# EAGLE design chassis_board (EAGLE 9.6.2)
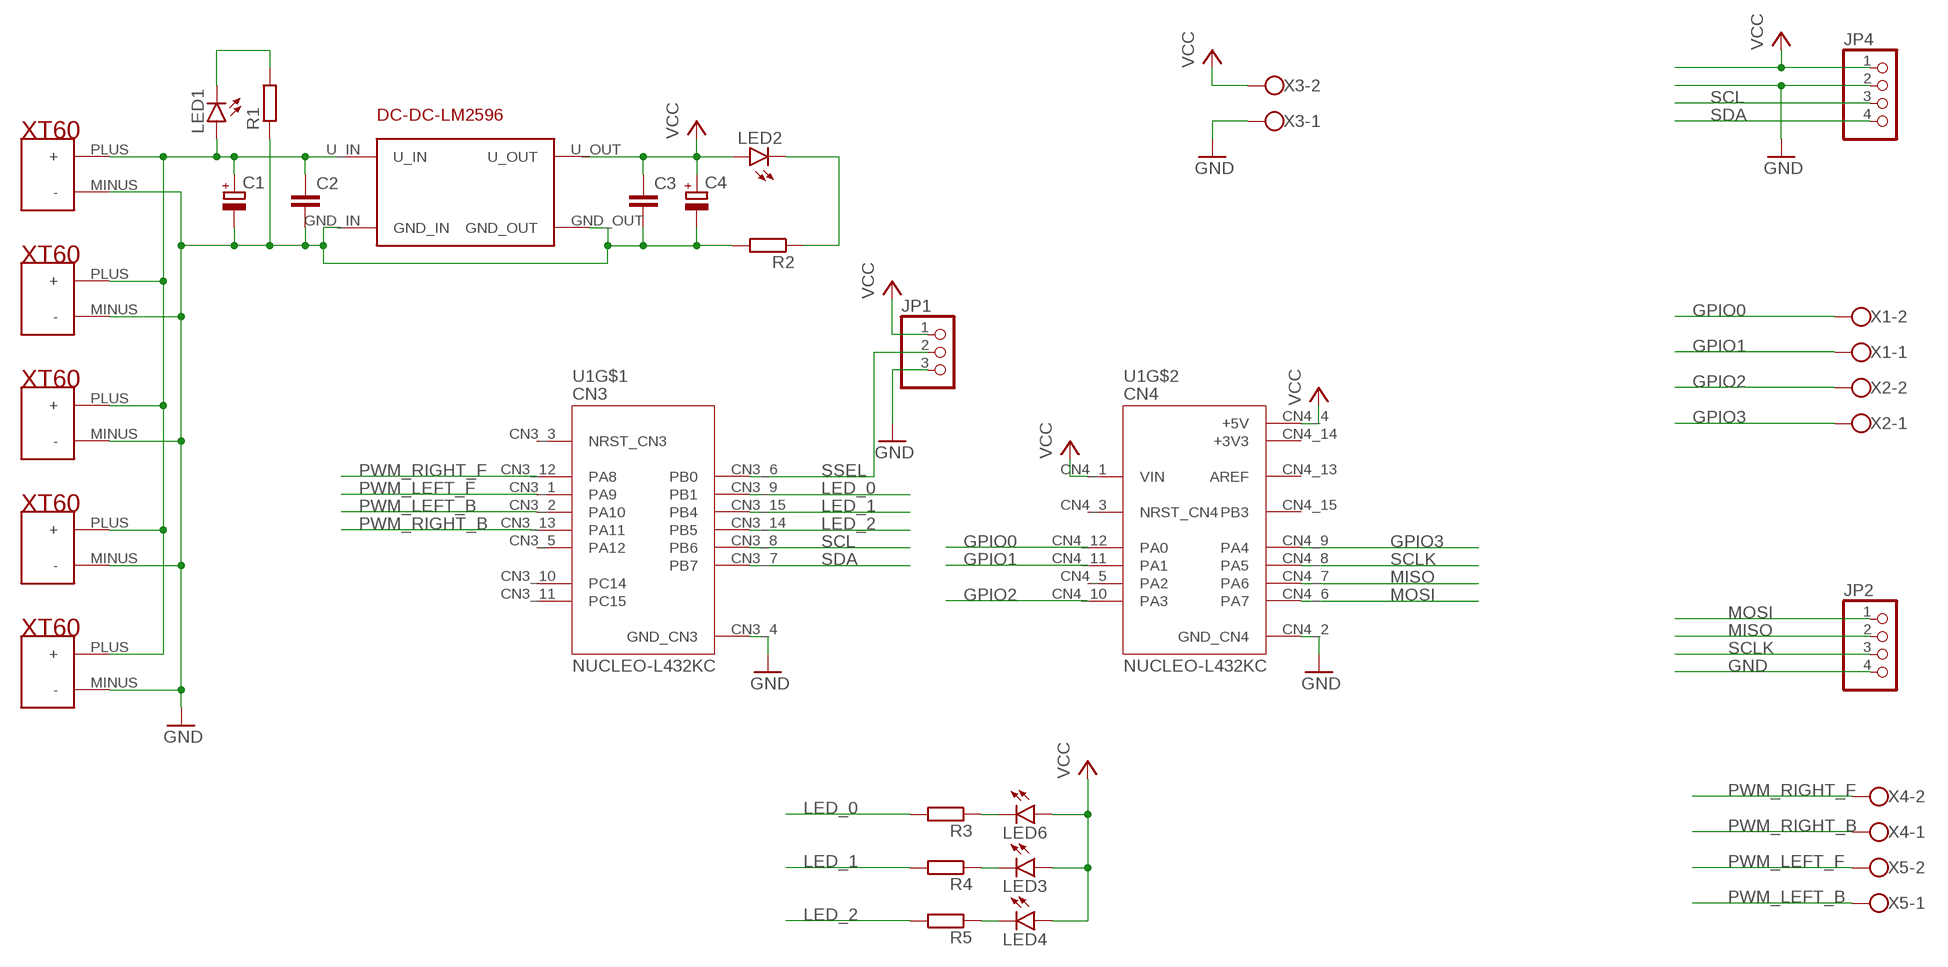
[diagram p0: schematic, sheet 1]

## Parts
C1  CPOL-EU140CLH-0810  [140CLH-0810]
C2  C-EUC1206  [C1206]
C3  C-EUC1206  [C1206]
C4  CPOL-EU140CLH-0810  [140CLH-0810]
JP1  PINHD-1X3  [1X03]
JP2  PINHD-1X4/90  [1X04/90]
JP4  PINHD-1X4/90  [1X04/90]
LED1  LEDSML1206  [SML1206]
LED2  LEDSML1206  [SML1206]
LED3  LEDSML1206  [SML1206]
LED4  LEDSML1206  [SML1206]
LED6  LEDSML1206  [SML1206]
R1  R-EU_M1206  [M1206]
R2  R-EU_M1206  [M1206]
R3  R-EU_M1206  [M1206]
R4  R-EU_M1206  [M1206]
R5  R-EU_M1206  [M1206]
U1  NUCLEO-L432KC  [MODULE_NUCLEO-L432KC]
U$1  XT60  [XT60_FOOTPRINT]
U$2  XT60  [XT60_FOOTPRINT]
U$3  XT60  [XT60_FOOTPRINT]
U$4  XT60  [XT60_FOOTPRINT]
U$5  XT60  [XT60_FOOTPRINT]
U$6  DC-DC-LM2596  [DC-DC-LM2596]
X1  W237-102  [W237-102]
X2  W237-102  [W237-102]
X3  W237-102  [W237-102]
X4  W237-102  [W237-102]
X5  W237-102  [W237-102]

## Nets
GND: C1.- C2.2 C3.2 C4.- JP1.3 JP2.4 JP4.2 R1.1 R2.2 U1.CN3_4(GND_CN3) U1.CN4_2(GND_CN4) U$1.MINUS(-) U$2.MINUS(-) U$3.MINUS(-) U$4.MINUS(-) U$5.MINUS(-) U$6.GND_IN U$6.GND_OUT X3.1
GPIO0: U1.CN4_12(PA0) X1.2
GPIO1: U1.CN4_11(PA1) X1.1
GPIO2: U1.CN4_10(PA3) X2.2
GPIO3: U1.CN4_9(PA4) X2.1
LED_0: R3.2 U1.CN3_9(PB1)
LED_1: R4.2 U1.CN3_15(PB4)
LED_2: R5.2 U1.CN3_14(PB5)
MISO: JP2.2 U1.CN4_7(PA6)
MOSI: JP2.1 U1.CN4_6(PA7)
N$1: C1.+ C2.1 LED1.A U$1.PLUS(+) U$2.PLUS(+) U$3.PLUS(+) U$4.PLUS(+) U$5.PLUS(+) U$6.U_IN
N$2: LED2.C R2.1
N$3: LED6.C R3.1
N$4: LED1.C R1.2
N$7: LED3.C R4.1
N$8: LED4.C R5.1
PWM_LEFT_B: U1.CN3_2(PA10) X5.1
PWM_LEFT_F: U1.CN3_1(PA9) X5.2
PWM_RIGHT_B: U1.CN3_13(PA11) X4.1
PWM_RIGHT_F: U1.CN3_12(PA8) X4.2
SCL: JP4.3 U1.CN3_8(PB6)
SCLK: JP2.3 U1.CN4_8(PA5)
SDA: JP4.4 U1.CN3_7(PB7)
SSEL: JP1.2 U1.CN3_6(PB0)
VCC: C3.1 C4.+ JP1.1 JP4.1 LED2.A LED3.A LED4.A LED6.A U1.CN4_1(VIN) U1.CN4_4(+5V) U$6.U_OUT X3.2
Unconnected: U1.CN3_3(NRST_CN3) U1.CN3_5(PA12) U1.CN3_10(PC14) U1.CN3_11(PC15) U1.CN4_3(NRST_CN4) U1.CN4_5(PA2) U1.CN4_13(AREF) U1.CN4_15(PB3)

## Power pins joined to a net without a drawn wire
+3V3: U1.CN4_14(+3V3)

## Library data of the parts
C1 C4 = rcl:CPOL-EU: POLARIZED CAPACITOR, European symbol; SPICEPREFIX: C
C2 C3 = rcl:C-EU: CAPACITOR, European symbol; SPICEPREFIX: C
JP1 = pinhead:PINHD-1X3: PIN HEADER
JP2 JP4 = pinhead:PINHD-1X4: PIN HEADER
LED1-LED4 LED6 = led:LED: LED OSRAM: - CHIPLED LG R971, LG N971, LY N971, LG Q971, LY Q971, LO R971, LY R971 LH N974, LH R974 LS Q976, LO Q976, LY Q976 LO Q996 - Hyper CHIPLED LW Q18S LB Q993, LB Q99A, LB R99A - SideLED LS A670, LO A670, LY A670, LG A670, LP A670 LB A673, LV A673, LT A673, LW A673 LH A674 LY A675 LS A676, LA A676, LO A676, LY A676, LW A676 LS A679, LY A679, LG A679 - Hyper Micro SIDELED® LS Y876, LA Y876, LO Y876, LY Y876 LT Y87S - SmartLED LW L88C, LW L88S LB L89C, LB L89S, LG L890 LS L89K, LO L89K, LY L89K LS L896, LA L896, LO L896, LY L896 - TOPLED LS T670, LO T670, LY T670, LG T670, LP T670 LSG T670, LSP T670, LSY T670, LOP T670, LYG T670 LG T671, LOG T671, LSG T671 LB T673, LV T673, LT T673, LW T673 LH T674 LS T676, LA T676, LO T676, LY T676, LB T676, LH T676, LSB T676, LW T676 LB T67C, LV T67C, LT T67C, LS T67K, LO T67K, LY T67K, LW E67C LS E67B, LA E67B, LO E67B, LY E67B, LB E67C, LV E67C, LT E67C LW T67C LS T679, LY T679, LG T679 LS T770, LO T770, LY T770, LG T770, LP T770 LB T773, LV T773, LT T773, LW T773 LH T774 LS E675, LA E675, LY E675, LS T675 LS T776, LA T776, LO T776, LY T776, LB T776 LHGB T686 LT T68C, LB T68C - Hyper Mini TOPLED® LB M676 - Mini TOPLED Santana® LG M470 LS M47K, LO M47K, LY M47K Source: http://www.osram.convergy.de LUXEON: - LUMILED® LXK2-PW12-R00, LXK2-PW12-S00, LXK2-PW14-U00, LXK2-PW14-V00 LXK2-PM12-R00, LXK2-PM12-S00, LXK2-PM14-U00 LXK2-PE12-Q00, LXK2-PE12-R00, LXK2-PE12-S00, LXK2-PE14-T00, LXK2-PE14-U00 LXK2-PB12-K00, LXK2-PB12-L00, LXK2-PB12-M00, LXK2-PB14-N00, LXK2-PB14-P00, LXK2-PB14-Q00 LXK2-PR12-L00, LXK2-PR12-M00, LXK2-PR14-Q00, LXK2-PR14-R00 LXK2-PD12-Q00, LXK2-PD12-R00, LXK2-PD12-S00 LXK2-PH12-R00, LXK2-PH12-S00 LXK2-PL12-P00, LXK2-PL12-Q00, LXK2-PL12-R00 Source: www.luxeon.com KINGBRIGHT: KA-3528ASYC Source: www.kingbright.com
R1-R5 = rcl:R-EU_: RESISTOR, European symbol; SPICEPREFIX: R
U1 = NUCLEO-L432KC:NUCLEO-L432KC: STM32 Nucleo-32 development board with STM32L432KC MCU, supports Arduino connectivity Check prices <https://pricing.snapeda.com/parts/NUCLEO-L432KC/STMicroelectronics/view-part?ref=eda>; AVAILABILITY: Warning; DESCRIPTION: STM32L432KC, mbed-Enabled Development Nucleo-32 STM32L4 ARM® Cortex®-M4 MCU 32-Bit Embedded Evaluation Board; MF: STMicroelectronics; MP: NUCLEO-L432KC; PACKAGE: None; PRICE: None; PURCHASE-URL: https://pricing.snapeda.com/search/part/NUCLEO-L432KC/?ref=eda
U$1-U$5 = XT_connectors:XT60
U$6 = gramofon:DC-DC-LM2596
X1-X5 = con-wago-500:W237-102: WAGO SCREW CLAMP; MPN: 237-102; OC_FARNELL: unknown; OC_NEWARK: 70K9898

## Board
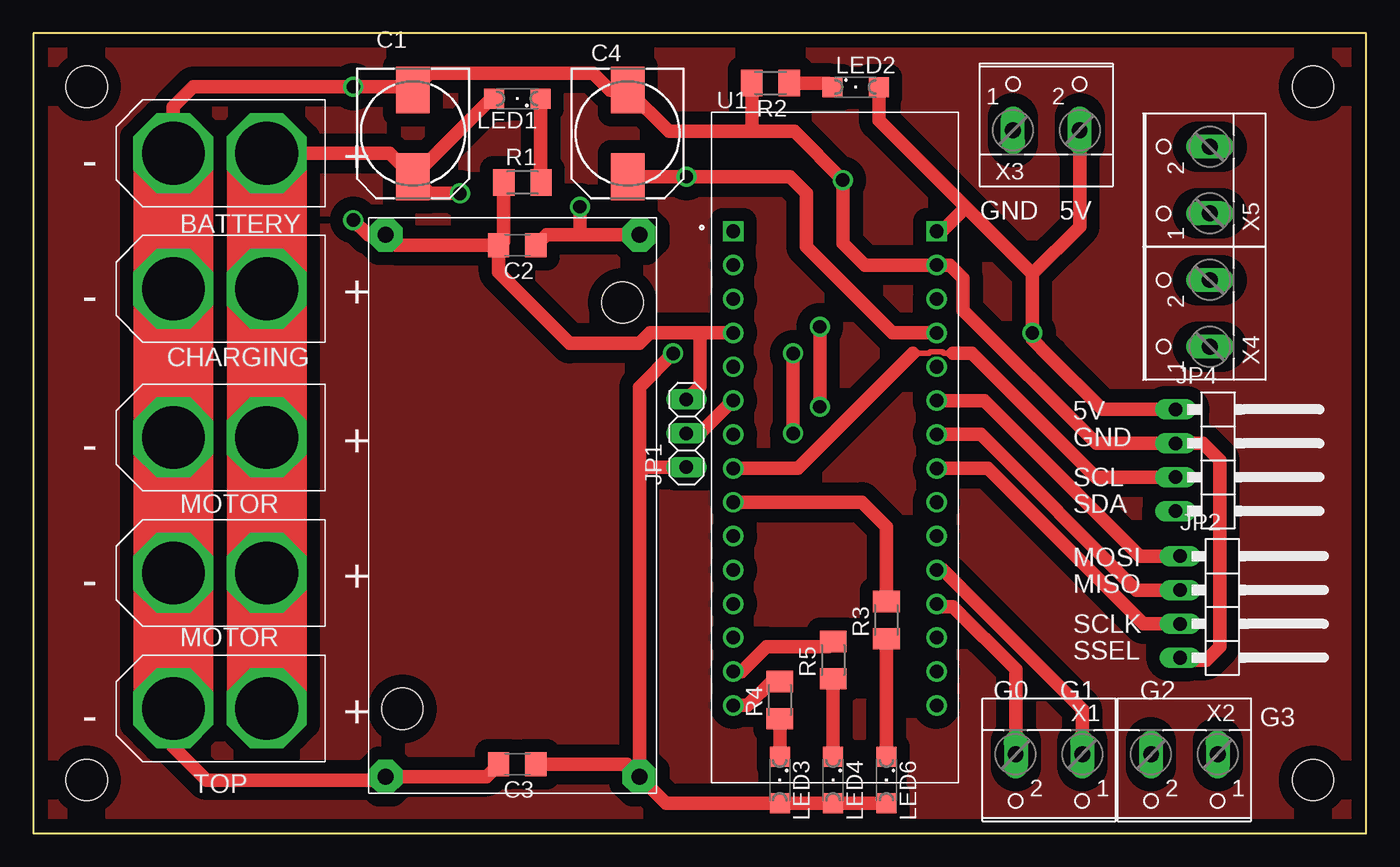
[diagram p1: board, top side]
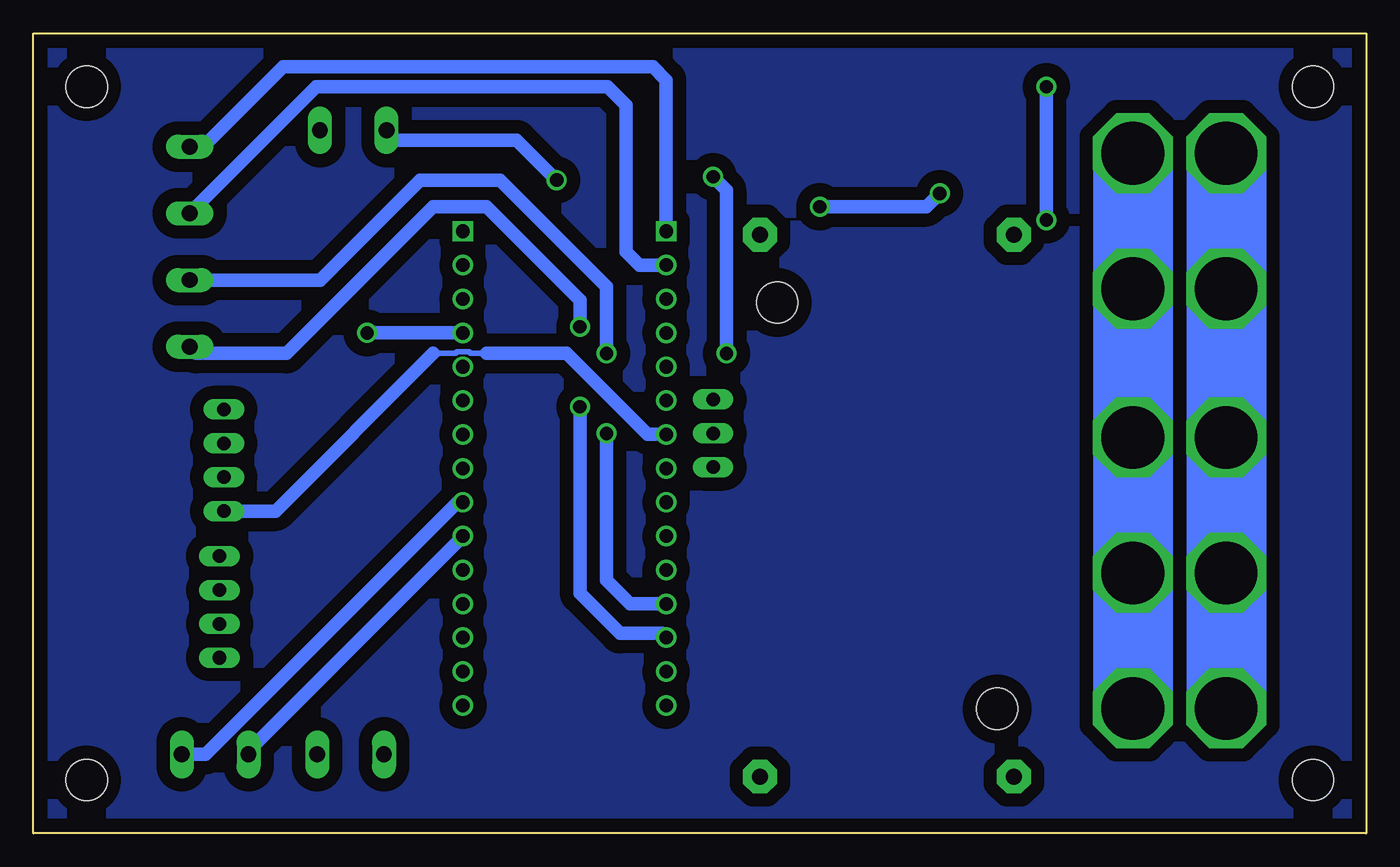
[diagram p2: board, bottom side, seen from below]

Size 100 x 60 mm. Coordinates in mm from the lower left corner, seen from the top.
Outline: 0,0 100,0 100,60 0,60 0,0
Copper layers (1*16): Top 0.035mm / dielectric 1.5mm / Bottom 0.035mm
Design rules "default": minimum track width 6mil, minimum drill 0.35mm, track to track 6mil, track to pad 6mil, pad to pad 6mil, via to via 6mil, smd to smd 6mil, copper to edge 40mil, drill to drill 6mil, minimum pad ring 10mil, minimum via ring 8mil, stop-mask expansion 4mil, vias tented up to drill 0mil, thermal gap 10mil
Holes 3.1 mm at 4,56 96,56 96,4 4,4

### Footprints (pad centres in the part's own frame; a part is rotated, then mirrored left to right if it is on the bottom)
140CLH-0810 = smd 3.5 x 2.5: + 3.25,0; - -3.25,0
C1206 = smd 1.6 x 1.8: 1 -1.4,0; 2 1.4,0
1X03 = drill 1.016 long: 1 -2.54,0; 2 0,0; 3 2.54,0
1X04/90 = drill 1.016 long: 1 -3.81,-3.81; 2 -1.27,-3.81; 3 1.27,-3.81; 4 3.81,-3.81
SML1206 = smd 1.5 x 1.5: A 1.75,0; C -1.75,0
M1206 = smd 1.6 x 2: 1 -1.4,0; 2 1.4,0
MODULE_NUCLEO-L432KC = drill 1.02 square: CN3_1 -7.62,16.215; CN4_1 7.62,16.215 | drill 1.02: CN3_2 -7.62,13.675; CN3_3 -7.62,11.135; CN3_4 -7.62,8.595; CN3_5 -7.62,6.055; CN3_6 -7.62,3.515; CN3_7 -7.62,0.975; CN3_8 -7.62,-1.565; CN3_9 -7.62,-4.105; CN3_10 -7.62,-6.645; CN3_11 -7.62,-9.185; CN3_12 -7.62,-11.725; CN3_13 -7.62,-14.265; CN3_14 -7.62,-16.805; CN3_15 -7.62,-19.345; CN4_2 7.62,13.675; CN4_3 7.62,11.135; CN4_4 7.62,8.595; CN4_5 7.62,6.055; CN4_6 7.62,3.515; CN4_7 7.62,0.975; CN4_8 7.62,-1.565; CN4_9 7.62,-4.105; CN4_10 7.62,-6.645; CN4_11 7.62,-9.185; CN4_12 7.62,-11.725; CN4_13 7.62,-14.265; CN4_14 7.62,-16.805; CN4_15 7.62,-19.345
XT60_FOOTPRINT = drill 4.7 pad 6 octagon: MINUS 11.4,4; PLUS 4.4,4
DC-DC-LM2596 = drill 1.2 pad 2.54 octagon: GND_IN 1.27,41.91; GND_OUT 1.27,1.27; U_IN 20.32,41.91; U_OUT 20.32,1.27 | hole 3.1: 2.54,6.35; 19.05,36.83
W237-102 = drill 1.194 long: 1 -2.5,-1.27; 2 2.5,-1.27

### Placement (x,y rotation side)
C1  28.48,52.5 270 top
C2  36.31,44.09 180 top
C3  36.31,5.17 180 top
C4  44.59,52.5 270 top
JP1  49,30 90 top
JP2  89.84,16.98 270 top
JP4  89.52,27.98 270 top
LED1  36.31,55.11 180 top
LED2  61.69,55.97 0 top
LED3  56,4 270 top
LED4  60,4 270 top
LED6  64,4 270 top
R1  36.69,48.81 0 top
R2  55.31,56.27 180 top
R3  64,16 90 top
R4  56,10 90 top
R5  60,13 90 top
U1  60.14,28.94 0 top
U$1  21.91,13.37 180 top
U$2  21.91,23.53 180 top
U$3  21.91,33.69 180 top
U$4  21.91,44.85 180 top
U$5  21.91,55.01 180 top
U$6  25.15,2.99 0 top
X1  76.2,4.65 180 top
X2  86.36,4.65 180 top
X3  76,54 0 top
X4  87,39 90 top
X5  87,49 90 top

### Tracks (layer width: path | path; a pad name or v marks a point on that pad's centre or on a via)
GND  (via drill 1)
  Top 1: C2.2 27.23,44.09 U$6.GND_IN 25.1,44.9 v24,46 | 35,44.09 C2.2 | C3.2 34,4.26 U$6.GND_OUT 26.16,4 13,4 10.51,6.49 U$1.MINUS | 43.25,55.75 42,57 29.73,57 C1.- 28.23,56 v24,56 12,56 10.51,54.51 U$5.MINUS | U1.CN3_4 50,37.53 | 50,37.53 46.25,37.53 45.47,36.75 40.25,36.75 34.91,42.09 C2.2 | v60.73,49 60.73,44.27 62.38,42.62 U1.CN4_2 68.76,42.62 69.76,41.62 69.76,39.24 79.75,29.25 JP4.2 87.75,29.25 89,28 89,14 88,13 86.2,13 JP2.4 | JP1.3 50,33.54 50,37.53
  Top 1.016: R1.1 35.29,44.38 35,44.09 | 43.25,55.75 C4.- 47.7,52.64 54,52.64 | v60.73,49 57.09,52.64 54,52.64 | R2.2 53.91,52.73 54,52.64
  Top 6: U$5.MINUS U$1.MINUS
  Bottom 1: v24,46 v24,56 | v60.73,49 63.73,52 | 72.5,52 72.77,52 X3.1
  Bottom 1.016: 63.73,52 72.5,52
  Bottom 6: U$5.MINUS U$4.MINUS U$3.MINUS U$2.MINUS U$1.MINUS
GPIO0
  Top 1: U1.CN4_12 67.97,17 69,17 73.7,12.3 X1.2
GPIO1
  Top 1: U1.CN4_11 68.25,19.75 78.7,9.3 X1.1
GPIO2
  Bottom 1: U1.CN4_10 84,6.06 X2.2
GPIO3
  Bottom 1: U1.CN4_9 68.17,24.84 87.08,5.92 X2.1
LED_0
  Top 1: U1.CN3_9 62.16,24.84 64,23 R3.2
LED_1
  Top 1: U1.CN3_15 53.59,9.6 55.4,11.4 R4.2
LED_2
  Top 1: U1.CN3_14 53.13,12.13 55,14 59.6,14 R5.2
MISO
  Top 1: U1.CN4_7 71.08,29.91 82.75,18.25 JP2.2
MOSI
  Top 1: U1.CN4_6 71.36,32.45 83.03,20.79 JP2.1
N$1  (via drill 1)
  Top 1: U$6.U_IN 41,44.9 38.52,44.9 C2.1 | U$5.PLUS 26.72,51.01 C1.+
  Top 1.016: LED1.A 34.34,55.11 C1.+ 29.73,48 v32,48 | 41,44.9 v41,47
  Top 6: U$5.PLUS U$1.PLUS
  Bottom 1.016: v41,47 33,47 v32,48
  Bottom 6: U$5.PLUS U$4.PLUS U$3.PLUS U$2.PLUS U$1.PLUS
N$2
  Top 1.016: LED2.C 59.64,56.27 R2.1
N$3
  Top 1: LED6.C R3.1
N$4
  Top 1: LED1.C 38.06,48.84 R1.2
N$5
  pour Top (isolate 1): 0,60 100,60 100,0 0,0
N$6
  pour Bottom (isolate 1): 0,60 100,60 100,0 0,0
N$7
  Top 1: LED3.C R4.1
N$8
  Top 1: LED4.C R5.1
PWM_LEFT_B
  Bottom 1.016: U1.CN3_2 54.52,42.62 55.52,43.62 55.52,54.62 56.91,56 78.77,56 X5.1
PWM_LEFT_F
  Bottom 1.016: X5.2 87.27,51.5 81.27,57.5 53.52,57.5 52.52,56.5 U1.CN3_1
PWM_RIGHT_B  (via drill 1)
  Top 1.016: v59,32 v59,38
  Bottom 1.016: U1.CN3_13 52.84,15 56,15 59,18 v59,32 | v59,38 59,40 66,47 70,47 81,36 87.77,36 X4.1
PWM_RIGHT_F  (via drill 1)
  Top 1.016: v57,30 v57,36
  Bottom 1.016: U1.CN3_12 55.22,17.21 57,19 v57,30 | v57,36 57,41 65,49 71,49 78.5,41.5 X4.2
SCL
  Top 0.4: 69,36 68.33,36 68.22,36.11 67.3,36.11 67.19,36 66,36
  Top 1: JP4.3 79.71,26.71 70.42,36 69,36 | U1.CN3_8 57.38,27.38 66,36
SCLK
  Top 1: U1.CN4_8 71.62,27.38 83.29,15.71 JP2.3
SDA
  Bottom 0.4: 70,36 68.33,36 68.22,36.11 67.3,36.11 67.19,36 66,36
  Bottom 1: 66,36 60,36 53.91,29.91 U1.CN3_7 | JP4.4 81.83,24.17 70,36
SSEL
  Top 1: JP1.2 50,30 52.45,32.45 U1.CN3_6
VCC  (via drill 1)
  Top 1: U1.CN4_4 64.47,37.53 58,44 58,48 56.75,49.25 v49,49.25 C4.+ | C3.1 44.56,5.17 U$6.U_OUT | U$6.U_OUT 45.47,27 | 45.47,27 45.47,33.47 v48,36 | JP4.1 80.21,31.79 76.21,35.79 | JP1.1 45.93,27.46 45.47,27 | U1.CN4_1 68.16,45.16 69.95,46.95 | U$6.U_OUT 47.48,2.25 LED3.A LED4.A LED6.A
  Top 1.016: 76.21,35.79 74.95,37.05 v74.95,37.53 74.95,41.95 | X3.2 78.5,45.5 74.95,41.95 | 74.95,41.95 69.95,46.95 63.44,53.47 LED2.A
  Bottom 1: v48,36 48,48.25 v49,49.25 | v74.95,37.53 U1.CN4_4

### Text on the board
tPlace: GND | 5V
tNames: BATTERY | CHARGING | 5V | GND | SCL | MOTOR | SDA | MOSI | MISO | SCLK | MOTOR | SSEL | G0 | G1 | G2 | G3 | TOP